# EAGLE schematic EEZ DIB DCM224 r3B3 (EAGLE 7.2.0)
Assembly variants: Farnell, TME

## Sheet 1 of 4: Bias PS, DIB interface
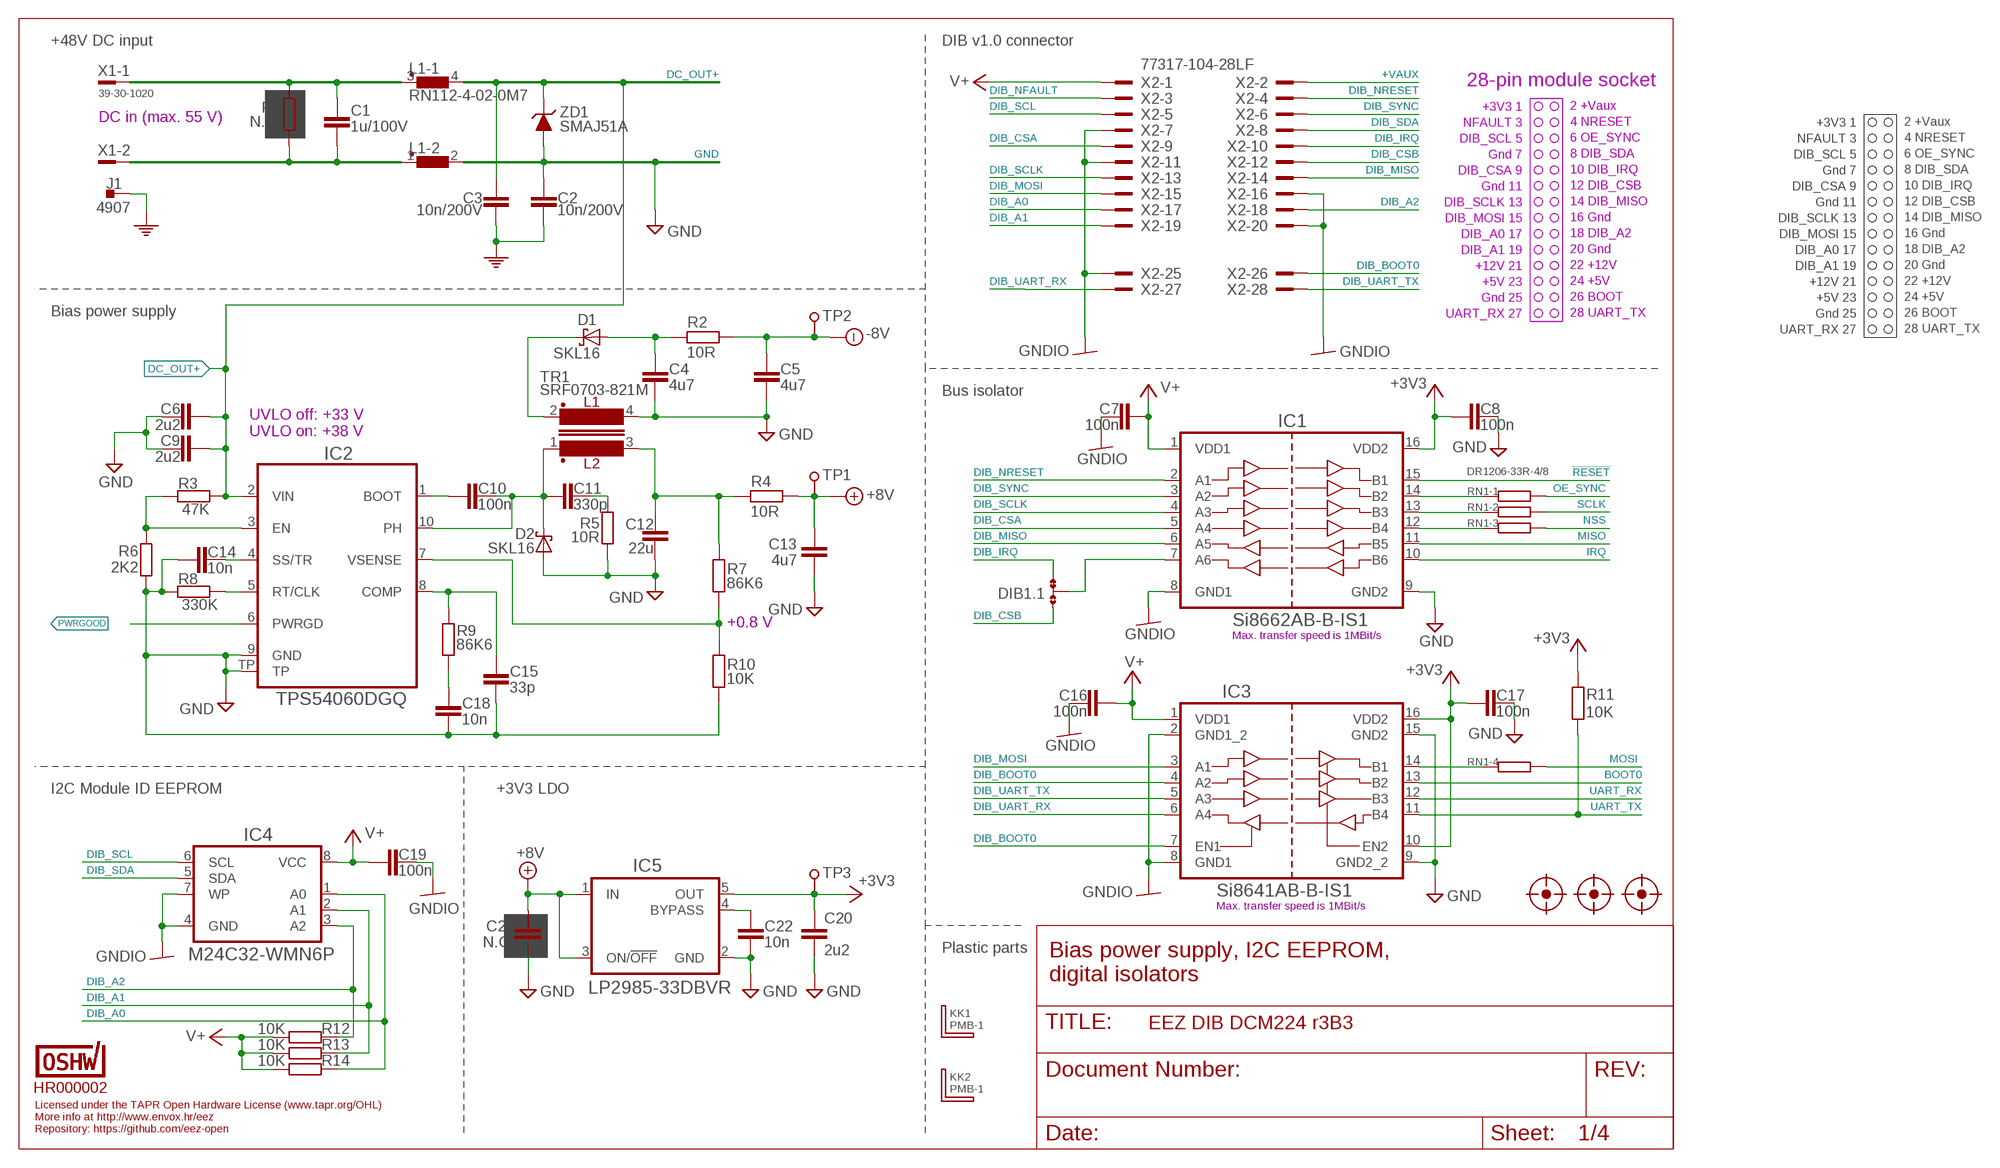
[diagram p0: schematic, sheet 1]

### Parts
C1  1u/100V  C-EUC1206  [C1206]
C2  10n/200V  C-EUC1206  [C1206]
C3  10n/200V  C-EUC1206  [C1206]
C4  4u7  C-EUC1206  [C1206]
C5  4u7  C-EUC1206  [C1206]
C6  2u2  C-EUC1206  [C1206]
C7  100n  C-EUC0603  [C0603]
C8  100n  C-EUC0603  [C0603]
C9  2u2  C-EUC1206  [C1206]
C10  100n  C-EUC0603  [C0603]
C11  330p  C-EUC0805  [C0805]
C12  22u  C-EUC1206  [C1206]
C13  4u7  C-EUC1206  [C1206]
C14  10n  C-EUC0805  [C0805]
C15  33p  C-EUC0603  [C0603]
C16  100n  C-EUC0603  [C0603]
C17  100n  C-EUC0603  [C0603]
C18  10n  C-EUC0805  [C0805]
C19  100n  C-EUC0603  [C0603]
C20  2u2  C-EUC1206  [C1206]
C21  N.C.  C-EUC0805  [C0805]
C22  10n  C-EUC0805  [C0805]
D1  SKL16  SCHOTTKYSOD123  [SOD123]
D2  SKL16  SCHOTTKYSOD123  [SOD123]
DIB1.1  JP3-CUT-0805-ROTATED  [JP3-0805-CUT2]
FM1  FIDUCIAL_2  [FIDUCIAL_DUAL]
FM2  FIDUCIAL_2  [FIDUCIAL_DUAL]
FM3  FIDUCIAL_2  [FIDUCIAL_DUAL]
IC1  Si8662AB-B-IS1  SI8662NSOIC-16  [SOIC-16]
IC2  TPS54060DGQ  [SOP50P490X110-11N]
IC3  Si8641AB-B-IS1  SI8641NSOIC-16  [SOIC-16]
IC4  M24C32-WMN6P  AT24CXXSOIC8  [SOIC127P600X173-8N]
IC5  LP2985-33DBVR  LP2985  [SOT95P270X145-5N]
J1  4907  PCB_TAB-4907  [PCB_TAB-4907]
KK1  PMB-1  PCB-MB  [PCB-MB]
KK2  PMB-1  PCB-MB  [PCB-MB]
L1  RN112-4-02-0M7  RN112  [RN112]
R1  N.C.  R-EU_R2512  [R2512]
R2  10R  R-EU_R0805  [R0805]
R3  47K  R-EU_R0805  [R0805]
R4  10R  R-EU_R0805  [R0805]
R5  10R  R-EU_R0805  [R0805]
R6  2K2  R-EU_R0805  [R0805]
R7  86K6  R-EU_R0805  [R0805]
R8  330K  R-EU_R0805  [R0805]
R9  86K6  R-EU_R0805  [R0805]
R10  10K  R-EU_R0805  [R0805]
R11  10K  R-EU_R0805  [R0805]
R12  10K  R-EU_R0805  [R0805]
R13  10K  R-EU_R0805  [R0805]
R14  10K  R-EU_R0805  [R0805]
RN1  DR1206-33R-4/8  R_ARRAY4  [CAY16]
TP1  TEST-PIN_0.9MM  [TEST-PIN_0.9MM]
TP2  TEST-PIN_0.9MM  [TEST-PIN_0.9MM]
TP3  TEST-PIN_0.9MM  [TEST-PIN_0.9MM]
TR1  SRF0703-821M  BOURNS_SRF0703INV  [SRF0703]
U$1  HR000002  CERT-SMALL  [CERT-SMALL-SILK]
X1  39-30-1020  MINIFIT_39301020  [MINIFIT_39301020]
X2  77317-104-28LF  [77317-104-28LF]
ZD1  SMAJ51A  P6SMB68A  [DO214AA]

### Nets
!RESET: IC1.15(B1) ; also sheet 2
+3V3: C8.2 C17.2 C20.1 IC1.16(VDD2) IC3.10(EN2) IC3.16(VDD2) IC5.5(OUT) R11.2 TP3.1 ; also sheet 2,3,4
+8V: C13.1 C21.2 IC5.1(IN) IC5.3(ON/!OFF) R4.1 TP1.1 ; also sheet 3
+VAUX: X2.2
-8V: C5.1 R2.1 TP2.1 ; also sheet 3
BOOT0: IC3.13(B2) ; also sheet 2
DC+: C1.2 L1.3 R1.2 X1.1
DC-: C1.1 L1.1 R1.1 X1.2
DC_OUT+: C3.2 C6.1 C9.1 IC2.2(VIN) L1.4 R3.2 ZD1.C ; also sheet 3,4
DIB_A0: IC4.1(A0) R14.2 X2.17
DIB_A1: IC4.2(A1) R13.2 X2.19
DIB_A2: IC4.3(A2) R12.2 X2.18
DIB_BOOT0: IC3.4(A2) IC3.7(EN1) X2.26
DIB_CSA: IC1.5(A4) X2.9
DIB_CSB: DIB1.1.NO X2.12
DIB_IRQ: DIB1.1.NC X2.10
DIB_MISO: IC1.6(A5) X2.14
DIB_MOSI: IC3.3(A1) X2.15
DIB_NFAULT: X2.3
DIB_NRESET: IC1.2(A1) X2.4
DIB_SCL: IC4.6(SCL) X2.5
DIB_SCLK: IC1.4(A3) X2.13
DIB_SDA: IC4.5(SDA) X2.8
DIB_SYNC: IC1.3(A2) X2.6
DIB_UART_RX: IC3.6(A4) X2.27
DIB_UART_TX: IC3.5(A3) X2.28
GND: C2.1 C4.2 C5.2 C6.2 C8.1 C9.2 C12.2 C13.2 C14.2 C15.1 C17.1 C18.1 C20.2 C21.1 C22.1 D2.A IC1.9(GND2) IC2.9(GND) IC2.TP IC3.9(GND2_2) IC3.15(GND2) IC5.2(GND) L1.2 R5.1 R6.1 R8.1 R10.1 TR1.4 ZD1.A ; also sheet 2,3,4
GNDIO: C7.2 C16.2 C19.1 IC1.8(GND1) IC3.2(GND1_2) IC3.8(GND1) IC4.4(GND) IC4.7(WP) X2.7 X2.11 X2.16 X2.20 X2.25
IRQ: IC1.10(B6) ; also sheet 2
MISO: IC1.11(B5) ; also sheet 2
MOSI: RN1.5 ; also sheet 2
N$4: IC1.14(B2) RN1.1
N$6: IC1.13(B3) RN1.2
N$9: IC1.12(B4) RN1.3
N$10: IC3.14(B1) RN1.4
N$33: C22.2 IC5.4(BYPASS)
N$53: C4.1 D1.A R2.2
N$245: C11.2 R5.2
N$248: IC2.3(EN) R3.1 R6.2
N$268: C14.1 IC2.4(SS/TR)
N$269: IC2.5(RT/CLK) R8.2
N$274: C15.2 IC2.8(COMP) R9.2
N$276: C18.2 R9.1
N$316: C10.2 IC2.1(BOOT)
N$478: IC2.7(VSENSE) R7.1 R10.2
N$2424: DIB1.1.COM IC1.7(A6)
NSS: RN1.6 ; also sheet 2
OE_SYNC: RN1.8 ; also sheet 2
PE: C2.2 C3.1 J1.1 J1.2 ; also sheet 3,4
PH1: C10.1 C11.1 D2.C IC2.10(PH) TR1.1
PWRGOOD: IC2.6(PWRGD) ; also sheet 2
SCLK: RN1.7 ; also sheet 2
UART_RX: IC3.12(B3) ; also sheet 2
UART_TX: IC3.11(B4) R11.1 ; also sheet 2
V+: C7.1 C16.1 C19.2 IC1.1(VDD1) IC3.1(VDD1) IC4.8(VCC) R12.1 R13.1 R14.1 X2.1
VOUT+: C12.1 R4.2 R7.2 TR1.3
VOUT-: D1.C TR1.2
Unconnected: X2.21 X2.22 X2.23 X2.24

### Notes on the sheet
- +48V DC input | DIB v1.0 connector
- 28-pin module socket
- +3V3 1
- 2 +Vaux
- NFAULT 3 | +3V3 1
- DC in (max. 55 V)
- 4 NRESET | 2 +Vaux
- DIB_SCL 5 | NFAULT 3
- 6 OE_SYNC | 4 NRESET
- Gnd 7 | DIB_SCL 5
- 8 DIB_SDA | 6 OE_SYNC
- DIB_CSA 9 | Gnd 7
- 10 DIB_IRQ | 8 DIB_SDA
- Gnd 11 | DIB_CSA 9
- 12 DIB_CSB | 10 DIB_IRQ
- DIB_SCLK 13 | Gnd 11
- 14 DIB_MISO | 12 DIB_CSB
- DIB_MOSI 15 | DIB_SCLK 13
- 16 Gnd | 14 DIB_MISO
- DIB_A0 17 | DIB_MOSI 15
- 18 DIB_A2 | 16 Gnd
- DIB_A1 19 | DIB_A0 17
- 20 Gnd | 18 DIB_A2
- +12V 21 | DIB_A1 19
- 22 +12V | 20 Gnd
- +5V 23 | +12V 21
- 24 +5V | 22 +12V
- Gnd 25 | +5V 23
- 26 BOOT | 24 +5V
- Bias power supply
- UART_RX 27 | Gnd 25
- 28 UART_TX | 26 BOOT
- UART_RX 27
- 28 UART_TX
- Bus isolator
- UVLO off: +33 V
  UVLO on: +38 V
- +0.8 V
- Max. transfer speed is 1MBit/s
- I2C Module ID EEPROM | +3V3 LDO
- Max. transfer speed is 1MBit/s
- Plastic parts
- Bias power supply, I2C EEPROM,
  digital isolators
- Licensed under the TAPR Open Hardware License (www.tapr.org/OHL)
- More info at http://www.envox.hr/eez
- Repository: https://github.com/eez-open

## Sheet 2 of 4: Digital control
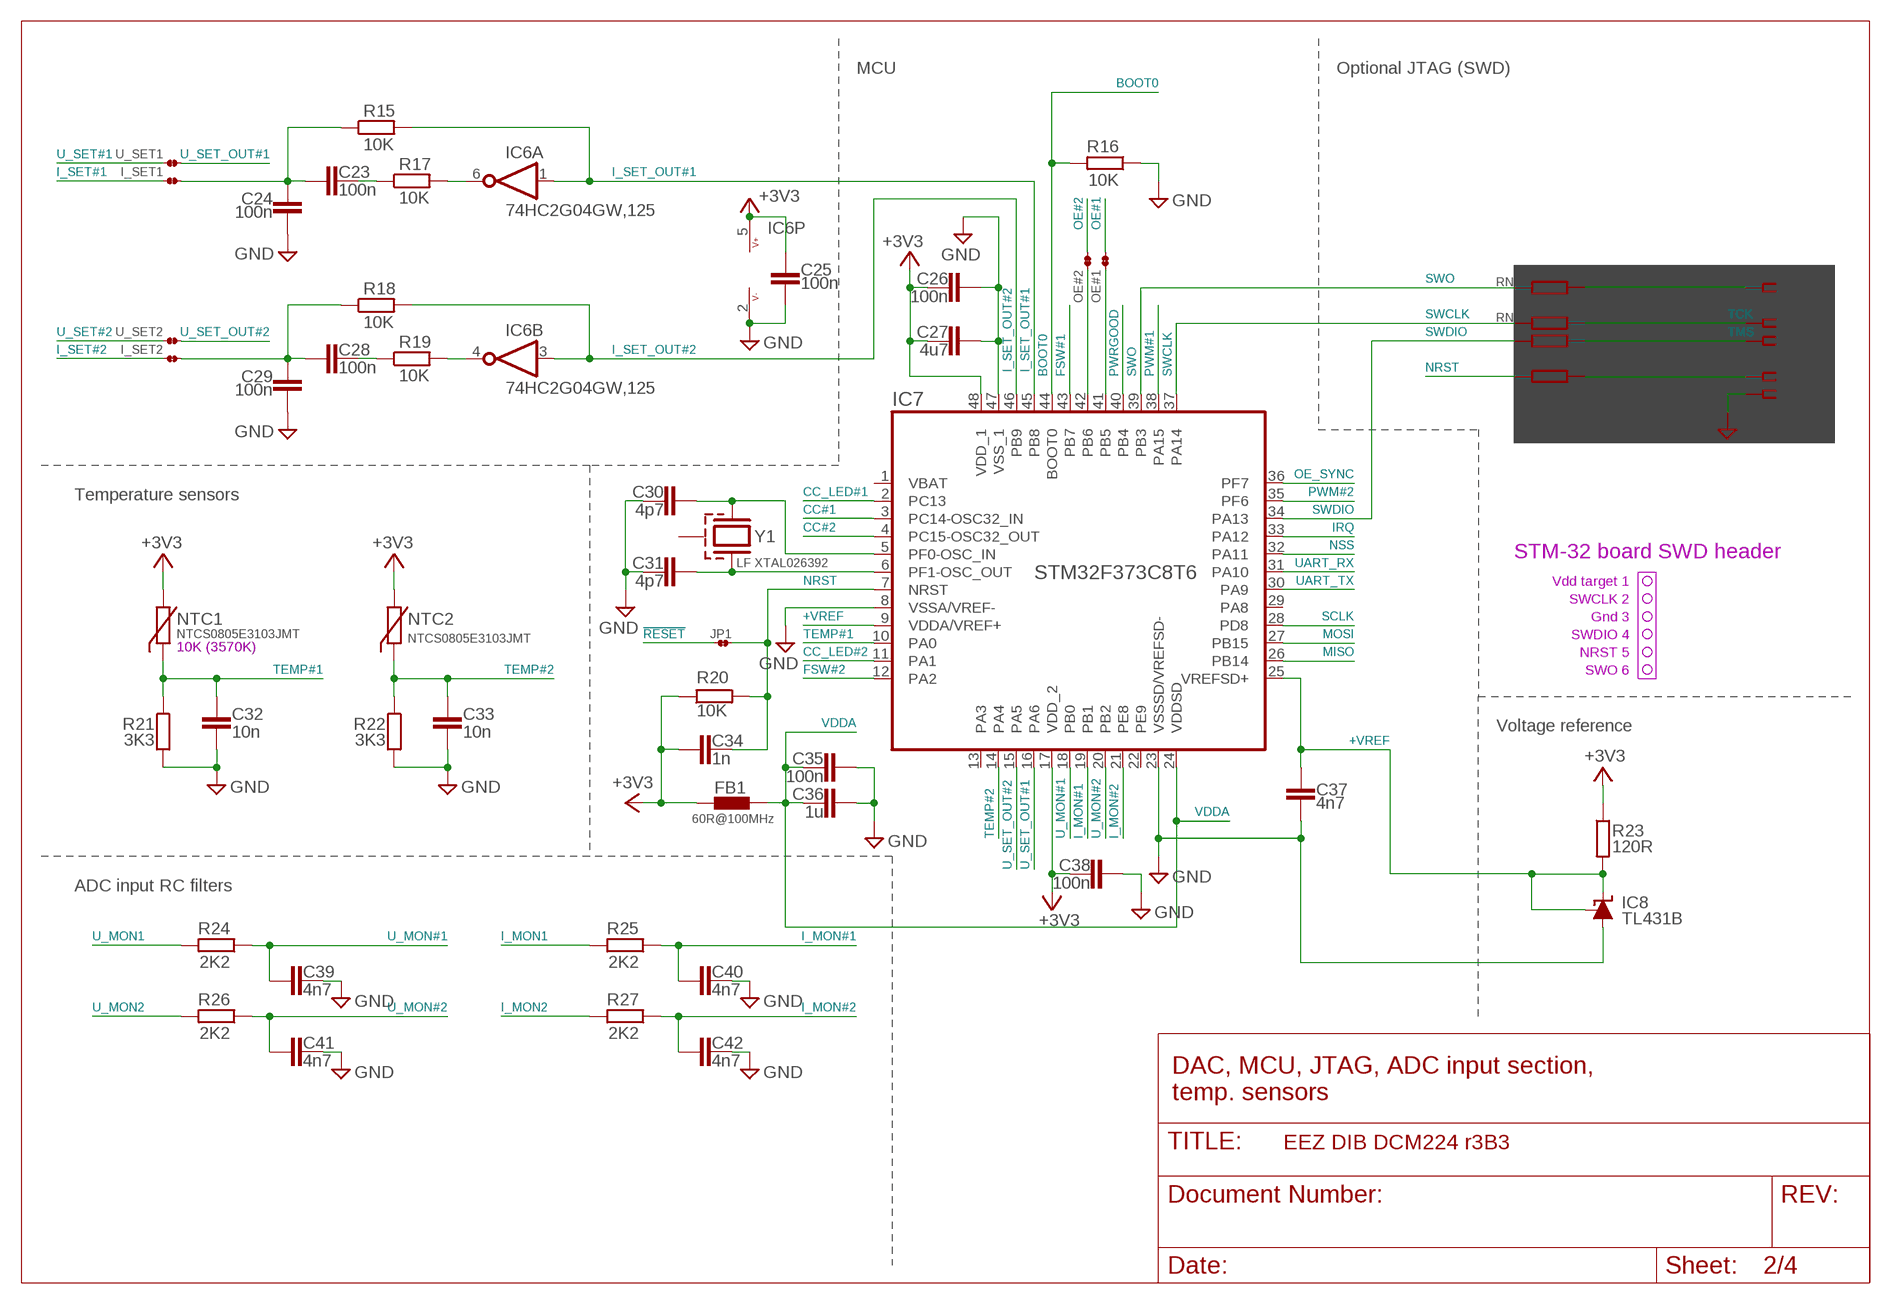
[diagram p1: schematic, sheet 2]

### Parts
C23  100n  C-EUC0603  [C0603]
C24  100n  C-EUC0603  [C0603]
C25  100n  C-EUC0603  [C0603]
C26  100n  C-EUC0603  [C0603]
C27  4u7  C-EUC1206  [C1206]
C28  100n  C-EUC0603  [C0603]
C29  100n  C-EUC0603  [C0603]
C30  4p7  C-EUC0603  [C0603]
C31  4p7  C-EUC0603  [C0603]
C32  10n  C-EUC0805  [C0805]
C33  10n  C-EUC0805  [C0805]
C34  1n  C-EUC0805  [C0805]
C35  100n  C-EUC0603  [C0603]
C36  1u  C-EUC0805  [C0805]
C37  4n7  C-EUC0805  [C0805]
C38  100n  C-EUC0603  [C0603]
C39  4n7  C-EUC0805  [C0805]
C40  4n7  C-EUC0805  [C0805]
C41  4n7  C-EUC0805  [C0805]
C42  4n7  C-EUC0805  [C0805]
FB1  60R@100MHz  FERRITE_BEAD0603  [BEAD0603]
I_SET1  JP2-NOCUT  [JP2-NOCUT]
I_SET2  JP2-NOCUT  [JP2-NOCUT]
IC6  74HC2G04GW,125  74HC2G04  [SOT65P210X110-6N]
IC7  STM32F373C8T6  [LQFP-48]
IC8  TL431B  TL431  [SOT103P240X110-3N]
JP1  JP2-NOCUT  [JP2-NOCUT]
NTC1  NTCS0805E3103JMT  NTCR_0805  [R_0805]
NTC2  NTCS0805E3103JMT  NTCR_0805  [R_0805]
OE#1  JP2-NOCUT  [JP2-NOCUT]
OE#2  JP2-NOCUT  [JP2-NOCUT]
R15  10K  R-EU_R0805  [R0805]
R16  10K  R-EU_R0805  [R0805]
R17  10K  R-EU_R0805  [R0805]
R18  10K  R-EU_R0805  [R0805]
R19  10K  R-EU_R0805  [R0805]
R20  10K  R-EU_R0805  [R0805]
R21  3K3  R-EU_R0805  [R0805]
R22  3K3  R-EU_R0805  [R0805]
R23  120R  R-EU_R0805  [R0805]
R24  2K2  R-EU_R0805  [R0805]
R25  2K2  R-EU_R0805  [R0805]
R26  2K2  R-EU_R0805  [R0805]
R27  2K2  R-EU_R0805  [R0805]
RN2  N.C.  R_ARRAY4  [CAY16]
U_SET1  JP2-NOCUT  [JP2-NOCUT]
U_SET2  JP2-NOCUT  [JP2-NOCUT]
X3  N.C.  SSW-106-02-S-S  [SSW-106-02-S-S]
Y1  LF XTAL026392  12SMX-B  [12SMX(B)]

### Nets
!RESET: JP1.1 ; also sheet 1
+3V3: C25.1 C26.2 C27.1 C34.2 C38.2 FB1.P$1 IC6.5(P:V+) IC7.17(VDD_2) IC7.48(VDD_1) NTC1.1 NTC2.1 R20.1 R23.1 ; also sheet 1,3,4
+VREF: C37.2 IC7.9(VDDA/VREF+) IC7.25(VREFSD+) IC8.1(C) IC8.2(R) R23.2
BOOT0: IC7.44(BOOT0) R16.2 ; also sheet 1
CC#1: IC7.3(PC14-OSC32_IN) ; also sheet 3
CC#2: IC7.4(PC15-OSC32_OUT) ; also sheet 4
CC_LED#1: IC7.2(PC13) ; also sheet 3
CC_LED#2: IC7.11(PA1) ; also sheet 4
FSW#1: IC7.43(PB7) ; also sheet 3
FSW#2: IC7.12(PA2) ; also sheet 4
GND: C24.2 C25.2 C26.1 C27.2 C29.2 C30.1 C31.1 C32.1 C33.1 C35.1 C36.1 C37.1 C38.1 C39.1 C40.1 C41.1 C42.1 IC6.2(P:V-) IC7.8(VSSA/VREF-) IC7.23(VSSSD/VREFSD-) IC7.47(VSS_1) IC8.3(A) R16.1 R21.2 R22.2 X3.3 ; also sheet 1,3,4
I_MON1: R25.2 ; also sheet 3
I_MON2: R27.2 ; also sheet 4
I_MON#1: C40.2 IC7.19(PB1) R25.1
I_MON#2: C42.2 IC7.21(PE8) R27.1
I_SET#1: I_SET1.1 ; also sheet 3
I_SET#2: I_SET2.1 ; also sheet 4
I_SET_OUT#1: IC6.1(A:I) IC7.45(PB8) R15.2
I_SET_OUT#2: IC6.3(B:I) IC7.46(PB9) R18.2
IRQ: IC7.33(PA12) ; also sheet 1
MISO: IC7.26(PB14) ; also sheet 1
MOSI: IC7.27(PB15) ; also sheet 1
N$40: C28.2 R19.1
N$44: C28.1 C29.1 I_SET2.2 R18.1
N$45: IC6.4(B:O) R19.2
N$49: RN2.8 X3.6
N$50: RN2.6 X3.5
N$246: C23.2 R17.1
N$247: C23.1 C24.1 I_SET1.2 R15.1
N$252: IC6.6(A:O) R17.2
N$481: IC7.42(PB6) OE#2.1
N$482: IC7.41(PB5) OE#1.1
NRST: C34.1 IC7.7(NRST) JP1.2 R20.2 RN2.3
NSS: IC7.32(PA11) ; also sheet 1
OE#1: OE#1.2 ; also sheet 3
OE#2: OE#2.2 ; also sheet 4
OE_SYNC: IC7.36(PF7) ; also sheet 1
PWM#1: IC7.38(PA15) ; also sheet 3
PWM#2: IC7.35(PF6) ; also sheet 4
PWRGOOD: IC7.40(PB4) ; also sheet 1
RCC_OSC_IN: C30.2 IC7.5(PF0-OSC_IN) Y1.3
RCC_OSC_OUT: C31.2 IC7.6(PF1-OSC_OUT) Y1.1
SCLK: IC7.28(PD8) ; also sheet 1
SWCLK: IC7.37(PA14) RN2.2
SWDIO: IC7.34(PA13) RN2.4
SWO: IC7.39(PB3) RN2.1
TCK: RN2.7 X3.2
TEMP#1: C32.2 IC7.10(PA0) NTC1.2 R21.1
TEMP#2: C33.2 IC7.14(PA4) NTC2.2 R22.1
TMS: RN2.5 X3.4
U_MON1: R24.2 ; also sheet 3
U_MON2: R26.2 ; also sheet 4
U_MON#1: C39.2 IC7.18(PB0) R24.1
U_MON#2: C41.2 IC7.20(PB2) R26.1
U_SET#1: U_SET1.1 ; also sheet 3
U_SET#2: U_SET2.1 ; also sheet 4
U_SET_OUT#1: IC7.16(PA6) U_SET1.2
U_SET_OUT#2: IC7.15(PA5) U_SET2.2
UART_RX: IC7.31(PA10) ; also sheet 1
UART_TX: IC7.30(PA9) ; also sheet 1
VDDA: C35.2 C36.2 FB1.P$2 IC7.24(VDDSD)
Unconnected: IC7.1(VBAT) IC7.13(PA3) IC7.22(PE9) IC7.29(PA8) X3.1 Y1.2(GND) Y1.4(GND)

### Notes on the sheet
- MCU | Optional JTAG (SWD)
- Temperature sensors
- STM-32 board SWD header
- Vdd target 1
- SWCLK 2
- Gnd 3
- SWDIO 4
- NRST 5
- 10K (3570K)
- SWO 6
- Voltage reference
- ADC input RC filters
- DAC, MCU, JTAG, ADC input section,
  temp. sensors

## Sheet 3 of 4: Channel #1
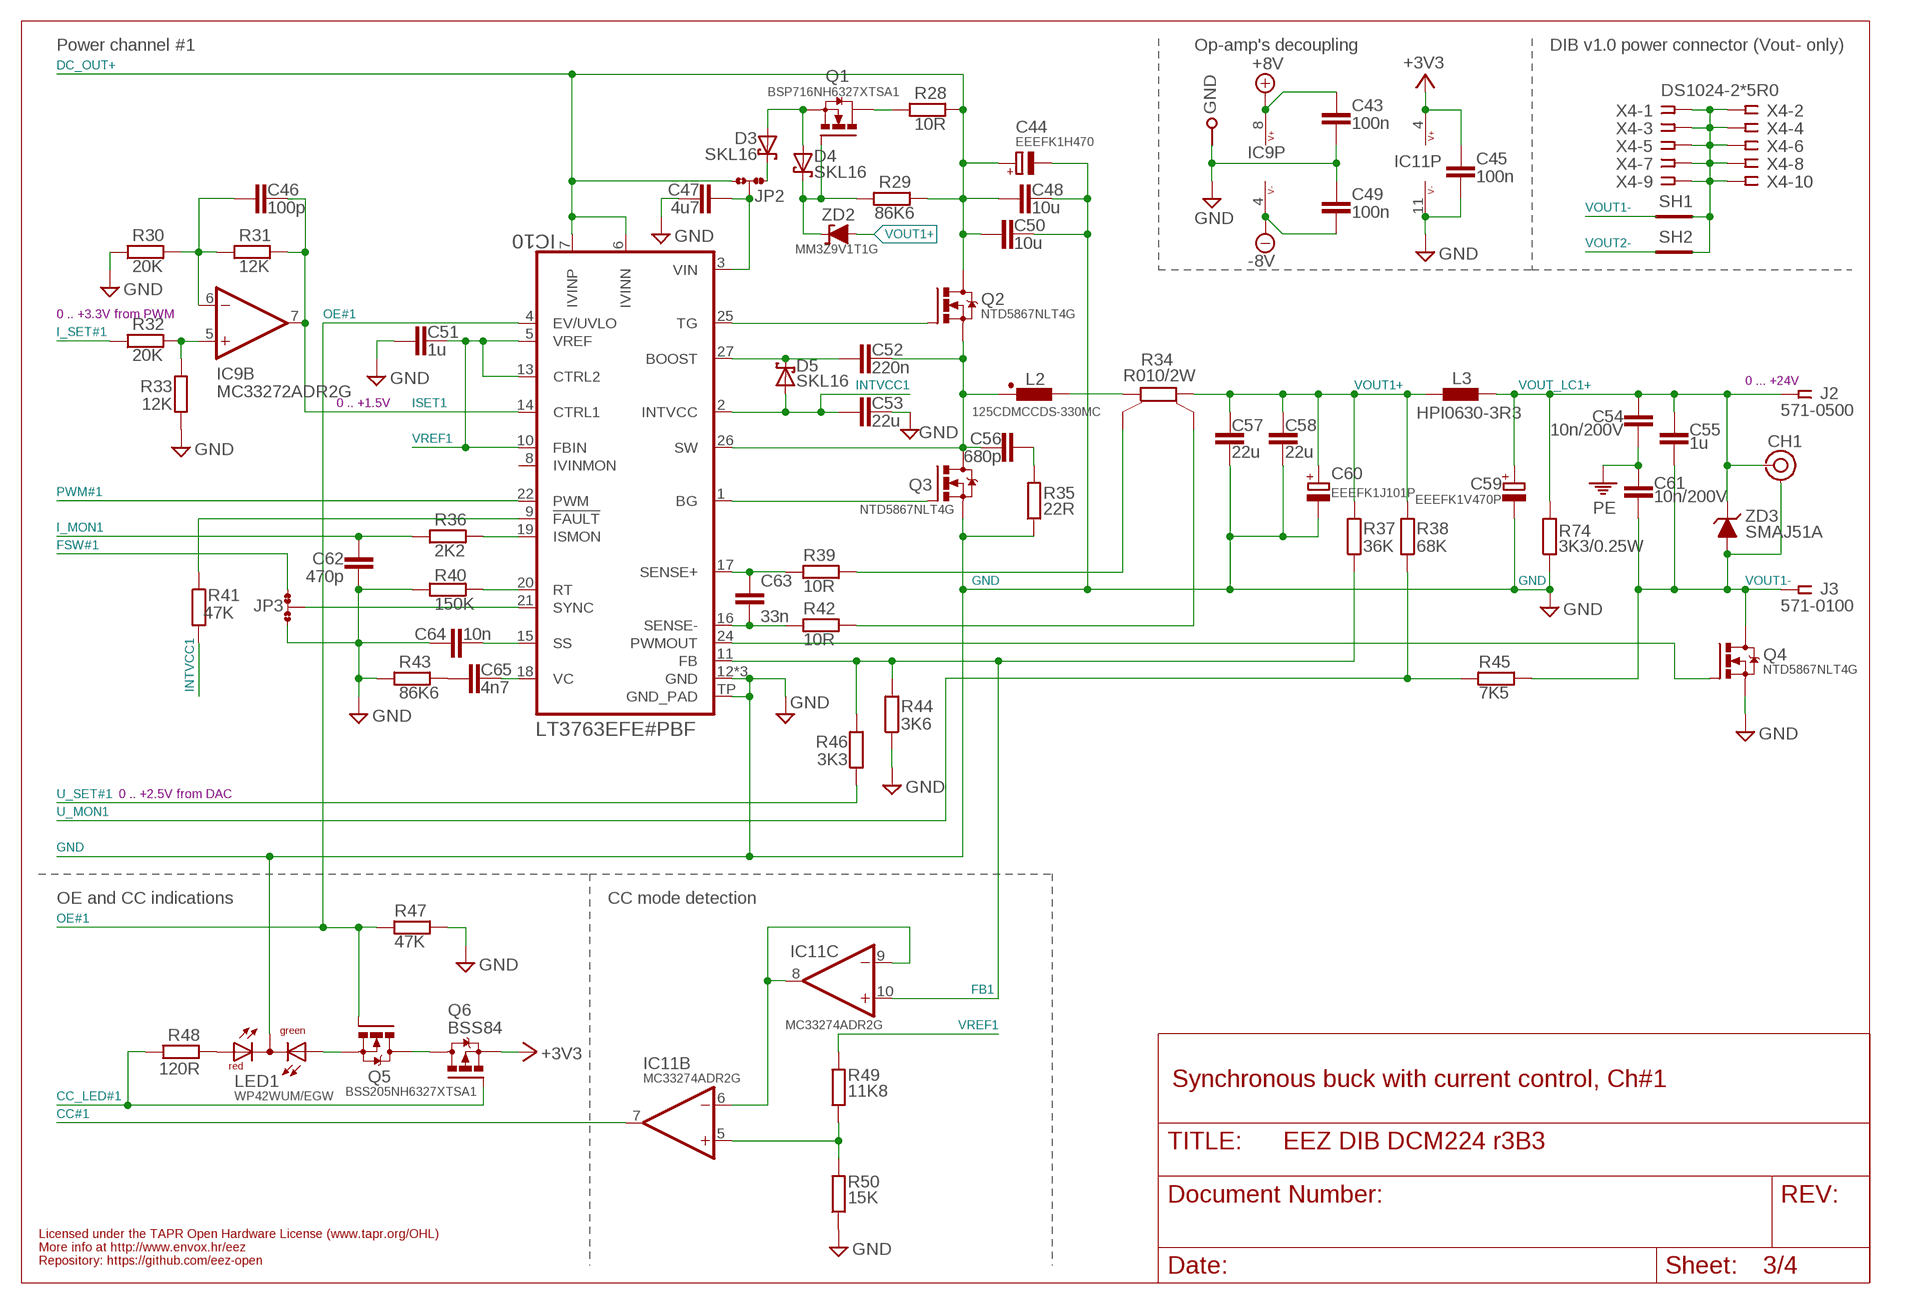
[diagram p2: schematic, sheet 3]

### Parts
C43  100n  C-EUC0603  [C0603]
C44  EEEFK1H470  ECAPSMD8.3MM/HA0  [CAPAE830X1050N]
C45  100n  C-EUC0603  [C0603]
C46  100p  C-EUC0805  [C0805]
C47  4u7  C-EUC1206  [C1206]
C48  10u  C-EUC1210  [C1210]
C49  100n  C-EUC0603  [C0603]
C50  10u  C-EUC1210  [C1210]
C51  1u  C-EUC0805  [C0805]
C52  220n  C-EUC0805  [C0805]
C53  22u  C-EUC1206  [C1206]
C54  10n/200V  C-EUC1206  [C1206]
C55  1u  C-EUC0805  [C0805]
C56  680p  C-EUC0805  [C0805]
C57  22u  C-EUC1210  [C1210]
C58  22u  C-EUC1210  [C1210]
C59  EEEFK1V470P  ECAPPANASONIC_H  [CAPAE660X610N]
C60  EEEFK1J101P  ECAP10X10  [CAPAE1030X1050N]
C61  10n/200V  C-EUC1206  [C1206]
C62  470p  C-EUC0805  [C0805]
C63  33n  C-EUC0805  [C0805]
C64  10n  C-EUC0805  [C0805]
C65  4n7  C-EUC0805  [C0805]
CH1  TEST_POINT-2  [TP_1.1MM_2]
D3  SKL16  SCHOTTKYSOD123  [SOD123]
D4  SKL16  SCHOTTKYSOD123  [SOD123]
D5  SKL16  SCHOTTKYSOD123  [SOD123]
GND  TEST-PIN_0.9MM  [TEST-PIN_0.9MM]
IC9  MC33272ADR2G  TL072SOIC8  [SOIC127P600X173-8N]
IC10  LT3763EFE#PBF  [LTC_05-08-1663-EB]
IC11  MC33274ADR2G  TL074SOIC14  [SOIC127P600X175-14N]
J2  571-0500  [DELTRON_571]
J3  571-0100  [DELTRON_571]
JP2  JP3-CUT-0805-ROTATED  [JP3-0805-CUT2]
JP3  JP3-CUT-0805-ROTATED  [JP3-0805-CUT2]
L2  125CDMCCDS-330MC  125CDMCC/DS  [125CDMCC/DS]
L3  HPI0630-3R3  COILCRAFT_HPI0630  [COILCRAFT_HPI0630]
LED1  WP42WUM/EGW  LED_L-42WUM/1EGWT  [L-42WUM-1EGWT]
Q1  BSP716NH6327XTSA1  N-HEXFET-2D_SOT232-IRLL014N  [SOT223]
Q2  NTD5867NLT4G  N-MOSFETDPAK  [TO252]
Q3  NTD5867NLT4G  N-MOSFETDPAK  [TO252]
Q4  NTD5867NLT4G  N-MOSFETDPAK  [TO252]
Q5  BSS205NH6327XTSA1  2N7002  [SOT103P240X110-3N]
Q6  BSS84  IRLML2246TRPBF  [SOT95P237X112-3N]
R28  10R  R-EU_R0805  [R0805]
R29  86K6  R-EU_R0805  [R0805]
R30  20K  R-EU_R0805  [R0805]
R31  12K  R-EU_R0805  [R0805]
R32  20K  R-EU_R0805  [R0805]
R33  12K  R-EU_R0805  [R0805]
R34  R010/2W  R-EU_4WIRE2512  [R_2512-4WIRE]
R35  22R  R-EU_R1206  [R1206]
R36  2K2  R-EU_R0805  [R0805]
R37  36K  R-EU_R0805  [R0805]
R38  68K  R-EU_R0805  [R0805]
R39  10R  R-EU_R0805  [R0805]
R40  150K  R-EU_R0805  [R0805]
R41  47K  R-EU_R0805  [R0805]
R42  10R  R-EU_R0805  [R0805]
R43  86K6  R-EU_R0805  [R0805]
R44  3K6  R-EU_R0805  [R0805]
R45  7K5  R-EU_R0805  [R0805]
R46  3K3  R-EU_R0805  [R0805]
R47  47K  R-EU_R0805  [R0805]
R48  120R  R-EU_R0805  [R0805]
R49  11K8  R-EU_R0805  [R0805]
R50  15K  R-EU_R0805  [R0805]
R74  3K3/0.25W  R-EU_R1206  [R1206]
SH1  SHORTNOHOLE  [SHORT_NOHOLE]
SH2  SHORTNOHOLE  [SHORT_NOHOLE]
X4  DS1024-2*5R0  SSW-105-02-T-D-RA  [SSW-105-02-T-D-RA]
ZD2  MM3Z9V1T1G  ZENER-DIODESOD323  [SOD323-W]
ZD3  SMAJ51A  P6SMB68A  [DO214AA]

### Nets
+3V3: C45.1 IC11.4(P:V+) Q6.2(S) ; also sheet 1,2,4
+8V: C43.1 IC9.8(P:V+) ; also sheet 1
-8V: C49.2 IC9.4(P:V-) ; also sheet 1
BG1: IC10.1(BG) Q3.1(G)
CC#1: IC11.7(B:OUT) ; also sheet 2
CC_LED#1: Q6.1(G) R48.2 ; also sheet 2
DC_OUT+: C44.+ C48.1 C50.1 IC10.6(IVINN) IC10.7(IVINP) JP2.NO Q2.3(D) R28.1 R29.1 ; also sheet 1,4
FB1: IC10.11(FB) IC11.10(C:+IN) R37.1 R44.2 R46.2
FSW#1: JP3.NC ; also sheet 2
GND: C43.2 C44.- C45.2 C47.2 C48.2 C49.1 C50.2 C51.2 C53.2 C57.2 C58.2 C59.2(-) C60.- C62.1 C64.1 GND.1 IC10.12(GND) IC10.23(GND) IC10.28(GND) IC10.TP(GND_PAD) IC11.11(P:V-) JP3.NO LED1.CC(C) Q3.2(S) Q4.2(S) R30.1 R33.1 R35.1 R40.1 R43.1 R44.1 R47.2 R50.1 R74.1 ; also sheet 1,2,4
I_MON1: C62.2 R36.1 ; also sheet 2
I_SET#1: R32.1 ; also sheet 2
INTVCC1: C53.1 D5.A IC10.2(INTVCC) R41.2
ISET1: C46.1 IC9.7(B:OUT) IC10.14(CTRL1) R31.2
LOUT1: L2.2 R34.1
N$1: IC10.21(SYNC) JP3.COM
N$2: D3.C JP2.NC
N$3: Q5.3(D) Q6.3(D)
N$7: R34.1S R39.2
N$8: IC10.20(RT) R40.2
N$11: LED1.RED(AR) R48.1
N$12: C64.2 IC10.15(SS)
N$13: C65.1 R43.2
N$14: C65.2 IC10.18(VC)
N$16: R34.2S R42.2
N$17: C56.2 R35.2
N$18: IC10.9(!FAULT) R41.1
N$22: C52.1 D5.C IC10.27(BOOST)
N$26: D4.C Q1.1(G) R29.2 ZD2.C
N$27: LED1.GREEN(AG) Q5.2(S)
N$39: C47.1 IC10.3(VIN) JP2.COM
N$43: D3.A D4.A Q1.3(S)
N$48: IC10.19(ISMON) R36.2
N$51: SH1.2(GND_B) SH2.2(GND_B) X4.1 X4.2 X4.3 X4.4 X4.5 X4.6 X4.7 X4.8 X4.9 X4.10
N$54: IC11.5(B:+IN) R49.1 R50.2
N$55: IC11.6(B:-IN) IC11.8(C:OUT) IC11.9(C:-IN)
N$250: IC9.5(B:+IN) R32.2 R33.2
N$251: C46.2 IC9.6(B:-IN) R30.2 R31.1
N$2422: IC10.24(PWMOUT) Q4.1(G)
OE#1: IC10.4(EV/UVLO) Q5.1(G) R47.1 ; also sheet 2
PE: C54.1 C61.1 ; also sheet 1,4
PWM#1: IC10.22(PWM) ; also sheet 2
Q1D: Q1.2(D) Q1.4(D) R28.2
SENSE1+: C63.1 IC10.17(SENSE+) R39.1
SENSE1-: C63.2 IC10.16(SENSE-) R42.1
SW1: C52.2 C56.1 IC10.26(SW) L2.1 Q2.2(S) Q3.3(D)
TG1: IC10.25(TG) Q2.1(G)
U_MON1: R38.1 R45.2 ; also sheet 2
U_SET#1: R46.1 ; also sheet 2
VOUT1+: C57.1 C58.1 C60.+ L3.1 R34.2 R37.2 R38.2 ZD2.A
VOUT1-: C55.2 C61.2 CH1.GND J3.1 J3.1.1 Q4.3(D) R45.1 SH1.1(GND_A) ZD3.A
VOUT2-: SH2.1(GND_A) ; also sheet 4
VOUT_LC1+: C54.2 C55.1 C59.1(+) CH1.TIP J2.1 J2.1.1 L3.2 R74.2 ZD3.C
VREF1: C51.1 IC10.5(VREF) IC10.10(FBIN) IC10.13(CTRL2) R49.2
Unconnected: IC10.8(IVINMON)

### Notes on the sheet
- Power channel #1 | Op-amp's decoupling | DIB v1.0 power connector (Vout- only)
- 0 .. +3.3V from PWM
- 0 ... +24V
- 0 .. +1.5V
- 0 .. +2.5V from DAC
- OE and CC indications | CC mode detection
- Synchronous buck with current control, Ch#1
- Licensed under the TAPR Open Hardware License (www.tapr.org/OHL)
- More info at http://www.envox.hr/eez
- Repository: https://github.com/eez-open

## Sheet 4 of 4: Channel #2
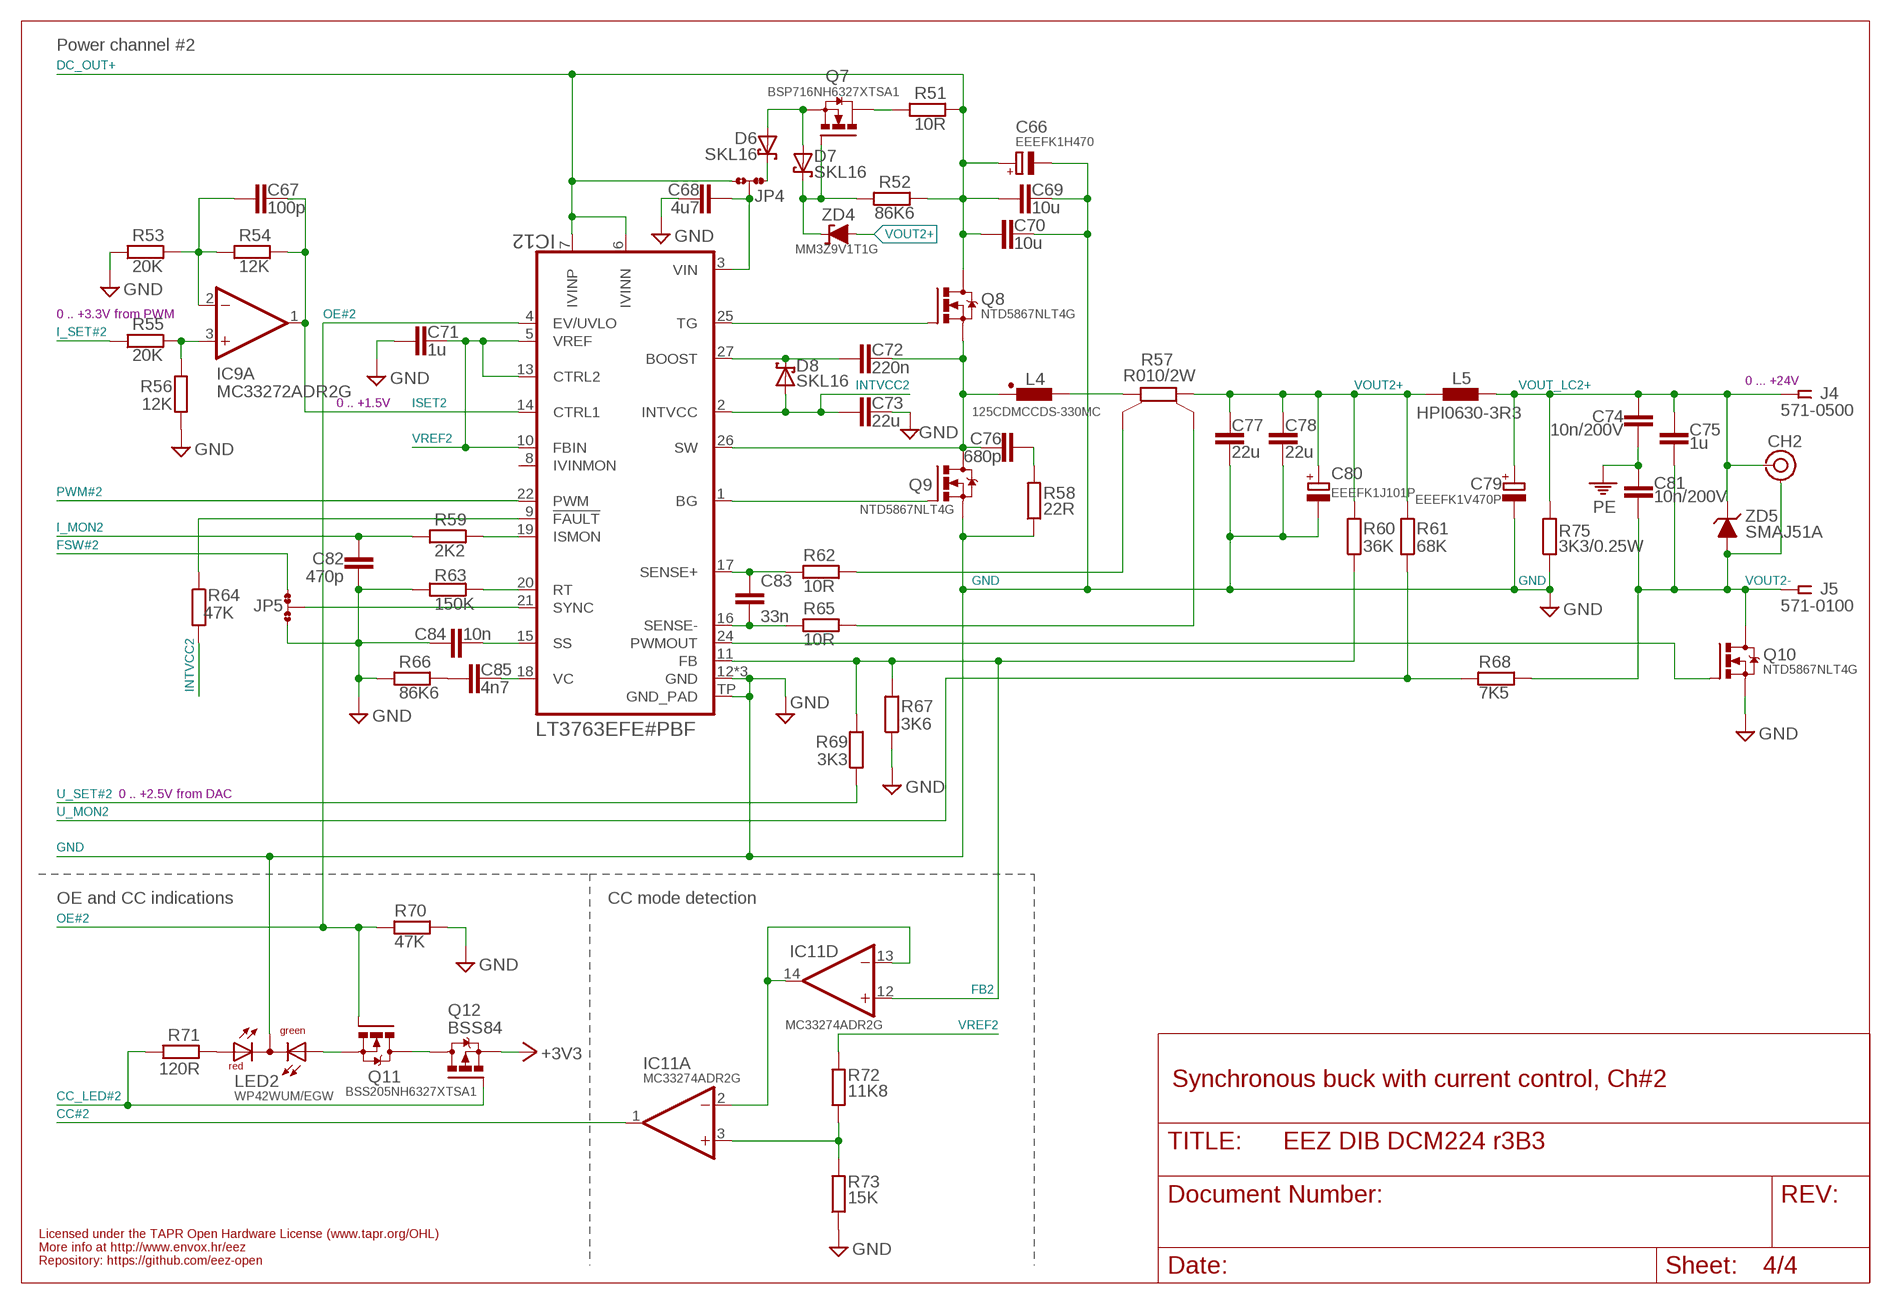
[diagram p3: schematic, sheet 4]

### Parts
C66  EEEFK1H470  ECAPSMD8.3MM/HA0  [CAPAE830X1050N]
C67  100p  C-EUC0805  [C0805]
C68  4u7  C-EUC1206  [C1206]
C69  10u  C-EUC1210  [C1210]
C70  10u  C-EUC1210  [C1210]
C71  1u  C-EUC0805  [C0805]
C72  220n  C-EUC0805  [C0805]
C73  22u  C-EUC1206  [C1206]
C74  10n/200V  C-EUC1206  [C1206]
C75  1u  C-EUC0805  [C0805]
C76  680p  C-EUC0805  [C0805]
C77  22u  C-EUC1210  [C1210]
C78  22u  C-EUC1210  [C1210]
C79  EEEFK1V470P  ECAPPANASONIC_H  [CAPAE660X610N]
C80  EEEFK1J101P  ECAP10X10  [CAPAE1030X1050N]
C81  10n/200V  C-EUC1206  [C1206]
C82  470p  C-EUC0805  [C0805]
C83  33n  C-EUC0805  [C0805]
C84  10n  C-EUC0805  [C0805]
C85  4n7  C-EUC0805  [C0805]
CH2  TEST_POINT-2  [TP_1.1MM_2]
D6  SKL16  SCHOTTKYSOD123  [SOD123]
D7  SKL16  SCHOTTKYSOD123  [SOD123]
D8  SKL16  SCHOTTKYSOD123  [SOD123]
IC12  LT3763EFE#PBF  [LTC_05-08-1663-EB]
J4  571-0500  [DELTRON_571]
J5  571-0100  [DELTRON_571]
JP4  JP3-CUT-0805-ROTATED  [JP3-0805-CUT2]
JP5  JP3-CUT-0805-ROTATED  [JP3-0805-CUT2]
L4  125CDMCCDS-330MC  125CDMCC/DS  [125CDMCC/DS]
L5  HPI0630-3R3  COILCRAFT_HPI0630  [COILCRAFT_HPI0630]
LED2  WP42WUM/EGW  LED_L-42WUM/1EGWT  [L-42WUM-1EGWT]
Q7  BSP716NH6327XTSA1  N-HEXFET-2D_SOT232-IRLL014N  [SOT223]
Q8  NTD5867NLT4G  N-MOSFETDPAK  [TO252]
Q9  NTD5867NLT4G  N-MOSFETDPAK  [TO252]
Q10  NTD5867NLT4G  N-MOSFETDPAK  [TO252]
Q11  BSS205NH6327XTSA1  2N7002  [SOT103P240X110-3N]
Q12  BSS84  IRLML2246TRPBF  [SOT95P237X112-3N]
R51  10R  R-EU_R0805  [R0805]
R52  86K6  R-EU_R0805  [R0805]
R53  20K  R-EU_R0805  [R0805]
R54  12K  R-EU_R0805  [R0805]
R55  20K  R-EU_R0805  [R0805]
R56  12K  R-EU_R0805  [R0805]
R57  R010/2W  R-EU_4WIRE2512  [R_2512-4WIRE]
R58  22R  R-EU_R1206  [R1206]
R59  2K2  R-EU_R0805  [R0805]
R60  36K  R-EU_R0805  [R0805]
R61  68K  R-EU_R0805  [R0805]
R62  10R  R-EU_R0805  [R0805]
R63  150K  R-EU_R0805  [R0805]
R64  47K  R-EU_R0805  [R0805]
R65  10R  R-EU_R0805  [R0805]
R66  86K6  R-EU_R0805  [R0805]
R67  3K6  R-EU_R0805  [R0805]
R68  7K5  R-EU_R0805  [R0805]
R69  3K3  R-EU_R0805  [R0805]
R70  47K  R-EU_R0805  [R0805]
R71  120R  R-EU_R0805  [R0805]
R72  11K8  R-EU_R0805  [R0805]
R73  15K  R-EU_R0805  [R0805]
R75  3K3/0.25W  R-EU_R1206  [R1206]
ZD4  MM3Z9V1T1G  ZENER-DIODESOD323  [SOD323-W]
ZD5  SMAJ51A  P6SMB68A  [DO214AA]

### Nets
+3V3: Q12.2(S) ; also sheet 1,2,3
BG2: IC12.1(BG) Q9.1(G)
CC#2: IC11.1(A:OUT) ; also sheet 2
CC_LED#2: Q12.1(G) R71.2 ; also sheet 2
DC_OUT+: C66.+ C69.1 C70.1 IC12.6(IVINN) IC12.7(IVINP) JP4.NO Q8.3(D) R51.1 R52.1 ; also sheet 1,3
FB2: IC11.12(D:+IN) IC12.11(FB) R60.1 R67.2 R69.2
FSW#2: JP5.NC ; also sheet 2
GND: C66.- C68.2 C69.2 C70.2 C71.2 C73.2 C77.2 C78.2 C79.2(-) C80.- C82.1 C84.1 IC12.12(GND) IC12.23(GND) IC12.28(GND) IC12.TP(GND_PAD) JP5.NO LED2.CC(C) Q9.2(S) Q10.2(S) R53.1 R56.1 R58.1 R63.1 R66.1 R67.1 R70.2 R73.1 R75.1 ; also sheet 1,2,3
I_MON2: C82.2 R59.1 ; also sheet 2
I_SET#2: R55.1 ; also sheet 2
INTVCC2: C73.1 D8.A IC12.2(INTVCC) R64.2
ISET2: C67.1 IC9.1(A:OUT) IC12.14(CTRL1) R54.2
LOUT2: L4.2 R57.1
N$15: LED2.RED(AR) R71.1
N$19: IC12.21(SYNC) JP5.COM
N$21: IC12.20(RT) R63.2
N$25: C84.2 IC12.15(SS)
N$28: C85.1 R66.2
N$34: C85.2 IC12.18(VC)
N$35: IC12.9(!FAULT) R64.1
N$36: R57.1S R62.2
N$37: R57.2S R65.2
N$38: C76.2 R58.2
N$41: C72.1 D8.C IC12.27(BOOST)
N$42: IC12.19(ISMON) R59.2
N$46: Q11.3(D) Q12.3(D)
N$47: LED2.GREEN(AG) Q11.2(S)
N$52: D7.C Q7.1(G) R52.2 ZD4.C
N$61: C68.1 IC12.3(VIN) JP4.COM
N$122: D6.A D7.A Q7.3(S)
N$249: D6.C JP4.NC
N$270: IC11.2(A:-IN) IC11.13(D:-IN) IC11.14(D:OUT)
N$271: IC11.3(A:+IN) R72.1 R73.2
N$278: C67.2 IC9.2(A:-IN) R53.2 R54.1
N$311: IC9.3(A:+IN) R55.2 R56.2
N$2423: IC12.24(PWMOUT) Q10.1(G)
OE#2: IC12.4(EV/UVLO) Q11.1(G) R70.1 ; also sheet 2
PE: C74.1 C81.1 ; also sheet 1,3
PWM#2: IC12.22(PWM) ; also sheet 2
Q1D1: Q7.2(D) Q7.4(D) R51.2
SENSE1+1: C83.1 IC12.17(SENSE+) R62.1
SENSE1-1: C83.2 IC12.16(SENSE-) R65.1
SW2: C72.2 C76.1 IC12.26(SW) L4.1 Q8.2(S) Q9.3(D)
TG2: IC12.25(TG) Q8.1(G)
U_MON2: R61.1 R68.2 ; also sheet 2
U_SET#2: R69.1 ; also sheet 2
VOUT2+: C77.1 C78.1 C80.+ L5.1 R57.2 R60.2 R61.2 ZD4.A
VOUT2-: C75.2 C81.2 CH2.GND J5.1 J5.1.1 Q10.3(D) R68.1 ZD5.A ; also sheet 3
VOUT_LC2+: C74.2 C75.1 C79.1(+) CH2.TIP J4.1 J4.1.1 L5.2 R75.2 ZD5.C
VREF2: C71.1 IC12.5(VREF) IC12.10(FBIN) IC12.13(CTRL2) R72.2
Unconnected: IC12.8(IVINMON)

### Notes on the sheet
- Power channel #2
- 0 .. +3.3V from PWM
- 0 ... +24V
- 0 .. +1.5V
- 0 .. +2.5V from DAC
- OE and CC indications | CC mode detection
- Synchronous buck with current control, Ch#2
- Licensed under the TAPR Open Hardware License (www.tapr.org/OHL)
- More info at http://www.envox.hr/eez
- Repository: https://github.com/eez-open

## Library data of the parts
C1-C43 C45-C58 C61-C65 C67-C78 C81-C85 = rcl:C-EU: CAPACITOR, European symbol
C44 C59 C60 C66 C79 C80 = EEZ_Lib1:ECAP
CH1 CH2 = EEZ_connectors:TEST_POINT: Test point for oscilloscope probe
D1-D8 = EEZ_Lib1:SCHOTTKY
DIB1.1 JP2-JP5 = EEZ_Lib1:JP3-CUT
FB1 = EEZ_Lib1:FERRITE_BEAD: FAIR-RITE - 2506033007Y3 - FERRITE BEAD, 0.04OHM, 3A, 0603 Farnell: 2112873
FM1-FM3 = EEZ_Lib1:FIDUCIAL: Fiducial mark for pick and place automation
GND TP1-TP3 = EEZ_connectors:TEST-PIN: Test pin
I_SET1 I_SET2 JP1 OE#1 OE#2 U_SET1 U_SET2 = EEZ_Lib1:JP2-NOCUT
IC1 = EEZ_Lib1:SI8662: Low power 6-ch digital isolator (4+2) Farnell: 2423351
IC2 = EEZ_Lib1:TPS54060: 0.5A, 60V Step Down SWIFT DC/DC Converter with ECO-MODE,MSOP-10; MPN: TPS54060ADGQ; OC_FARNELL: 2099922; OC_NEWARK: 05W5854; PACKAGE: MSOP-10; SUPPLIER: TEXAS INSTRUMENTS
IC3 = EEZ_Lib1:SI8641: Low power 4-ch digital isolator (3+1) Farnell: 2423288
IC4 = EEZ_Lib1:AT24CXX: I2C-Compatible (2-wire) Serial EEPROM
IC5 = EEZ_DIB:LP2985: 150-mA Low-noise Low-dropout Regulator With Shutdown
IC6 = EEZ_Lib1:74HC2G04: Dual inverter
IC7 = EEZ_DIB:STM32F373: ARM®Cortex®-M4 32b MCU+FPU
IC8 = EEZ_Lib1:TL431: Precision programmable reference
IC9 = EEZ_Lib1:TL072
IC10 IC12 = EEZ_Lib1:LT3763: 60V High Current Step-Down LED Driver Controller
IC11 = EEZ_Lib1:TL074: LOW-NOISE JFET-INPUT OPERATIONAL AMPLIFIERS; MPN: TL074ACD; OC_FARNELL: 9593349; OC_NEWARK: 52F2748; PACKAGE: SOIC-14; SUPPLIER: Texas Instruments
J1 = EEZ_connectors:PCB_TAB: PCB quick-fit terminal
J2-J5 = EEZ_connectors:571-0: Socket; 4mm banana; 10A; 250VDC; silver plated; PCB; insulated
KK1 KK2 = EEZ_Lib1:PCB-MB: Richo Mounting Block; 16 x 6 mm
L1 = EEZ_Lib1:RN112
L2 L4 = EEZ_inductors_and_transformers:125CDMCC/DS: Sumida SMD power inductor 13.8×12.9×5.0mm
L3 L5 = EEZ_inductors_and_transformers:COILCRAFT_HPI0630: High power inductor
LED1 LED2 = EEZ_Lib1:LED_L-42WUM/1EGWT: 3 mm right angle bicolor LED indicator
NTC1 NTC2 = EEZ_Lib1:NTC
Q1 Q7 = transistor-power:N-HEXFET-2D_?-*: HEXFET® Power MOSFET 2 Drain connects http://www.irf.com/product-info/datasheets/data/irll014n.pdf
Q2-Q4 Q8-Q10 = EEZ_Lib1:N-MOSFET
Q5 Q11 = EEZ_Lib1:2N7002: N-CHANNEL ENHANCEMENT MODE FIELD EFFECT TRANSISTOR; MPN: 2N7002-7-F; OC_FARNELL: 1713823; OC_NEWARK: 25R5679; PACKAGE: SOT-23-3; SUPPLIER: DIODES INC.
Q6 Q12 = EEZ_Lib1:IRLML2246TRPBF: HEXFET Power MOSFET (-20V, -2.6A); MPN: IRLML2246TRPBF; OC_FARNELL: 1888166; OC_NEWARK: 40T7450; PACKAGE: SOT-3; SUPPLIER: International Rectifier; TME: IRLML2246TRPBF
R1-R33 R35-R56 R58-R75 = rcl:R-EU_: RESISTOR, European symbol
R34 R57 = EEZ_Lib1:R-EU_4WIRE
RN1 RN2 = EEZ_Lib1:R_ARRAY4: 1206 four resistor array
SH1 SH2 = EEZ_Lib1:SHORT
TR1 = EEZ_inductors_and_transformers:BOURNS_SRF0703INV: Bourns SRF0703 Series - Dual-Winding Shielded Power Inductors
U$1 = OSHWA:CERT
X1 = EEZ_connectors:MINIFIT_39301020: Molex Socket; wire-board; male; Mini-Fit Jr; 4.2mm; PIN:2; THT; PCB snap
X2 = EEZ_connectors:77317-104-28LF: Headers & Wire Housings 28P right angle 0.1" pitch
X3 = con-samtec:SSW-106-02-S-S: THROUGH-HOLE .025" SQ POST SOCKET Source: Samtec SSW.pdf; MPN: SSW-106-02-S-S; OC_FARNELL: unknown; OC_NEWARK: 11P9416
X4 = EEZ_connectors:SSW-105-02-T-D-RA: Samtec SSW-105-02-T-D-RA Connector, Receptacle, 2.54MM, RA, 10-way; FARNELL: 2308470
Y1 = EEZ_Lib1:12SMX-B
ZD1 ZD3 ZD5 = EEZ_Lib1:P6SMB68A: Transient Voltage Suppression Diodes, DO-214AA
ZD2 ZD4 = EEZ_Lib1:ZENER-DIODE

## Net classes
0 default: width 0.203 mm, drill 0.3 mm, clearance 0.203 mm
1 lvds: width 0.152 mm, drill 0.3 mm, clearance 0.152 mm to class 0, clearance 0.152 mm
2 gnd: width 0.254 mm, drill 0.584 mm, clearance 0.254 mm